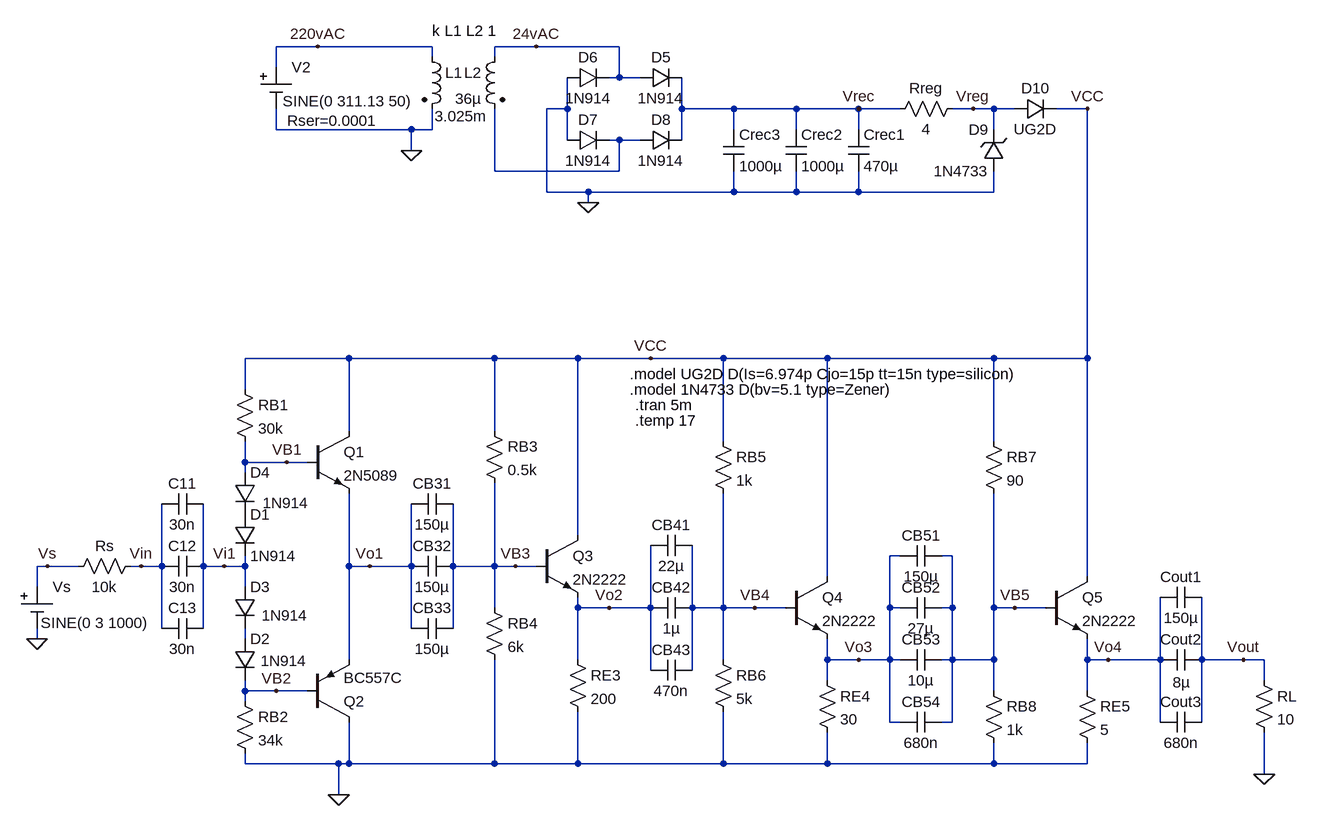
[diagram p0: schematic Draft2.asc]
Draft2.asc, the LTspice schematic file:
Version 4
SHEET 1 2888 1060
WIRE -672 -704 -736 -704
WIRE -496 -704 -672 -704
WIRE -336 -704 -400 -704
WIRE -208 -704 -336 -704
WIRE -496 -688 -496 -704
WIRE -400 -688 -400 -704
WIRE -736 -672 -736 -704
WIRE -208 -656 -208 -704
WIRE -208 -656 -224 -656
WIRE -176 -656 -208 -656
WIRE -288 -608 -288 -656
WIRE -288 -608 -320 -608
WIRE -112 -608 -112 -656
WIRE -32 -608 -112 -608
WIRE 64 -608 -32 -608
WIRE 160 -608 64 -608
WIRE 224 -608 160 -608
WIRE 336 -608 304 -608
WIRE 368 -608 336 -608
WIRE 400 -608 368 -608
WIRE 512 -608 464 -608
WIRE -736 -576 -736 -608
WIRE -528 -576 -736 -576
WIRE -496 -576 -496 -608
WIRE -496 -576 -528 -576
WIRE -32 -576 -32 -608
WIRE 64 -576 64 -608
WIRE 160 -576 160 -608
WIRE 368 -576 368 -608
WIRE -288 -560 -288 -608
WIRE -208 -560 -224 -560
WIRE -176 -560 -208 -560
WIRE -112 -560 -112 -608
WIRE -528 -544 -528 -576
WIRE -400 -512 -400 -608
WIRE -208 -512 -208 -560
WIRE -208 -512 -400 -512
WIRE -320 -480 -320 -608
WIRE -256 -480 -320 -480
WIRE -32 -480 -32 -512
WIRE -32 -480 -256 -480
WIRE 64 -480 64 -512
WIRE 64 -480 -32 -480
WIRE 160 -480 160 -512
WIRE 160 -480 64 -480
WIRE 368 -480 368 -512
WIRE 368 -480 160 -480
WIRE -256 -464 -256 -480
WIRE -624 -224 -784 -224
WIRE -400 -224 -624 -224
WIRE -272 -224 -400 -224
WIRE -160 -224 -272 -224
WIRE -48 -224 -160 -224
WIRE 112 -224 -48 -224
WIRE 368 -224 112 -224
WIRE 512 -224 512 -608
WIRE 512 -224 368 -224
WIRE -784 -176 -784 -224
WIRE -624 -112 -624 -224
WIRE -400 -112 -400 -224
WIRE -48 -96 -48 -224
WIRE 368 -96 368 -224
WIRE -784 -64 -784 -96
WIRE -720 -64 -784 -64
WIRE -688 -64 -720 -64
WIRE -784 -48 -784 -64
WIRE -272 48 -272 -224
WIRE 224 80 208 80
WIRE 304 80 288 80
WIRE -1088 96 -1104 96
WIRE -1040 96 -1088 96
WIRE -944 96 -960 96
WIRE -912 96 -912 0
WIRE -912 96 -944 96
WIRE -848 96 -848 0
WIRE -816 96 -848 96
WIRE -784 96 -784 80
WIRE -784 96 -816 96
WIRE -624 96 -624 -16
WIRE -592 96 -624 96
WIRE -528 96 -528 0
WIRE -528 96 -592 96
WIRE -464 96 -464 0
WIRE -400 96 -400 -32
WIRE -400 96 -464 96
WIRE -368 96 -400 96
WIRE -336 96 -368 96
WIRE 112 112 112 -224
WIRE 512 112 512 -224
WIRE -1104 128 -1104 96
WIRE -784 128 -784 96
WIRE -400 160 -400 96
WIRE -272 160 -272 144
WIRE -224 160 -272 160
WIRE -160 160 -160 64
WIRE -160 160 -224 160
WIRE -96 160 -96 64
WIRE -48 160 -48 -16
WIRE -48 160 -96 160
WIRE 0 160 -48 160
WIRE 48 160 0 160
WIRE 208 160 208 80
WIRE 224 160 208 160
WIRE 304 160 304 80
WIRE 304 160 288 160
WIRE 368 160 368 -16
WIRE 400 160 368 160
WIRE 448 160 400 160
WIRE -912 192 -912 96
WIRE -848 192 -848 96
WIRE -528 192 -528 96
WIRE -464 192 -464 96
WIRE -1104 208 -1104 192
WIRE -784 208 -784 192
WIRE -624 240 -624 96
WIRE -272 240 -272 160
WIRE -48 240 -48 160
WIRE 112 240 112 208
WIRE 160 240 112 240
WIRE 208 240 208 160
WIRE 208 240 160 240
WIRE 224 240 208 240
WIRE 304 240 304 160
WIRE 304 240 288 240
WIRE 368 240 368 160
WIRE 368 240 304 240
WIRE 512 240 512 208
WIRE 544 240 512 240
WIRE 624 240 624 144
WIRE 624 240 544 240
WIRE 688 240 688 144
WIRE 752 240 688 240
WIRE 784 240 752 240
WIRE -160 256 -160 160
WIRE -96 256 -96 160
WIRE 112 272 112 240
WIRE 784 272 784 240
WIRE -784 288 -784 272
WIRE -736 288 -784 288
WIRE -688 288 -736 288
WIRE 368 288 368 240
WIRE 512 288 512 240
WIRE -784 304 -784 288
WIRE 208 336 208 240
WIRE 224 336 208 336
WIRE 304 336 304 240
WIRE 304 336 288 336
WIRE 624 336 624 240
WIRE 688 336 688 240
WIRE -784 400 -784 384
WIRE -640 400 -784 400
WIRE -624 400 -624 336
WIRE -624 400 -640 400
WIRE -400 400 -400 240
WIRE -400 400 -624 400
WIRE -272 400 -272 320
WIRE -272 400 -400 400
WIRE -48 400 -48 320
WIRE -48 400 -272 400
WIRE 112 400 112 352
WIRE 112 400 -48 400
WIRE 368 400 368 368
WIRE 368 400 112 400
WIRE 512 400 512 368
WIRE 512 400 368 400
WIRE 784 416 784 352
WIRE -640 448 -640 400
FLAG -1104 208 0
FLAG -640 448 0
FLAG -528 -544 0
FLAG -256 -464 0
FLAG 784 416 0
FLAG -1088 96 Vs
FLAG -944 96 Vin
FLAG -816 96 Vi1
FLAG -160 -224 VCC
FLAG -720 -64 VB1
FLAG -736 288 VB2
FLAG -592 96 Vo1
FLAG -368 96 VB3
FLAG -224 160 Vo2
FLAG 0 160 VB4
FLAG 160 240 Vo3
FLAG 400 160 VB5
FLAG 544 240 Vo4
FLAG 752 240 Vout
FLAG -672 -704 220vAC
FLAG -336 -704 24vAC
FLAG 160 -608 Vrec
FLAG 336 -608 Vreg
FLAG 512 -608 VCC
SYMBOL Misc\\cell -1104 128 R0
WINDOW 123 0 0 Left 0
WINDOW 39 0 0 Left 0
WINDOW 3 6 55 Left 2
SYMATTR Value SINE(0 3 1000)
SYMATTR InstName Vs
SYMBOL res -944 80 R90
WINDOW 0 0 56 VBottom 2
WINDOW 3 32 56 VTop 2
SYMATTR InstName Rs
SYMATTR Value 10k
SYMBOL diode -800 16 R0
SYMATTR InstName D1
SYMATTR Value 1N914
SYMBOL diode -800 208 R0
WINDOW 3 40 34 Left 2
SYMATTR Value 1N914
SYMATTR InstName D2
SYMBOL res -800 -192 R0
SYMATTR InstName RB1
SYMATTR Value 30k
SYMBOL res -800 288 R0
SYMATTR InstName RB2
SYMATTR Value 34k
SYMBOL npn -688 -112 R0
SYMATTR InstName Q1
SYMATTR Value 2N5089
SYMBOL pnp -688 336 M180
SYMATTR InstName Q2
SYMATTR Value BC557C
SYMBOL cap -848 80 R90
WINDOW 0 0 32 VBottom 2
WINDOW 3 32 32 VTop 2
SYMATTR InstName C12
SYMATTR Value 30n
SYMBOL cap -464 80 R90
WINDOW 0 0 32 VBottom 2
WINDOW 3 32 32 VTop 2
SYMATTR InstName CB32
SYMATTR Value 150µ
SYMBOL res -416 -128 R0
SYMATTR InstName RB3
SYMATTR Value 0.5k
SYMBOL res -416 144 R0
SYMATTR InstName RB4
SYMATTR Value 6k
SYMBOL res -288 224 R0
SYMATTR InstName RE3
SYMATTR Value 200
SYMBOL npn -336 48 R0
SYMATTR InstName Q3
SYMATTR Value 2N2222
SYMBOL res 768 256 R0
SYMATTR InstName RL
SYMATTR Value 10
SYMBOL cap -96 144 R90
WINDOW 0 0 32 VBottom 2
WINDOW 3 32 32 VTop 2
SYMATTR InstName CB42
SYMATTR Value 1µ
SYMBOL res -64 -112 R0
SYMATTR InstName RB5
SYMATTR Value 1k
SYMBOL res -64 224 R0
SYMATTR InstName RB6
SYMATTR Value 5k
SYMBOL res 96 256 R0
SYMATTR InstName RE4
SYMATTR Value 30
SYMBOL npn 48 112 R0
SYMATTR InstName Q4
SYMATTR Value 2N2222
SYMBOL cap 288 224 R90
WINDOW 0 0 32 VBottom 2
WINDOW 3 32 32 VTop 2
SYMATTR InstName CB53
SYMATTR Value 10µ
SYMBOL res 352 -112 R0
SYMATTR InstName RB7
SYMATTR Value 90
SYMBOL res 352 272 R0
SYMATTR InstName RB8
SYMATTR Value 1k
SYMBOL res 496 272 R0
SYMATTR InstName RE5
SYMATTR Value 5
SYMBOL npn 448 112 R0
SYMATTR InstName Q5
SYMATTR Value 2N2222
SYMBOL cap 688 224 R90
WINDOW 0 0 32 VBottom 2
WINDOW 3 35 31 VTop 2
SYMATTR InstName Cout2
SYMATTR Value 8µ
SYMBOL diode -800 128 R0
WINDOW 3 42 44 Left 2
SYMATTR Value 1N914
SYMATTR InstName D3
SYMBOL diode -800 -48 R0
WINDOW 3 43 47 Left 2
SYMATTR Value 1N914
SYMATTR InstName D4
SYMBOL Misc\\cell -736 -672 R0
WINDOW 3 10 52 Left 2
WINDOW 123 0 0 Left 0
WINDOW 39 17 82 Left 2
SYMATTR Value SINE(0 311.13 50)
SYMATTR SpiceLine Rser=0.0001
SYMATTR InstName V2
SYMBOL ind2 -512 -704 R0
WINDOW 3 20 107 Left 2
SYMATTR Value 3.025m
SYMATTR InstName L1
SYMBOL ind2 -384 -704 M0
SYMATTR InstName L2
SYMATTR Value 36µ
SYMBOL cap 144 -576 R0
SYMATTR InstName Crec1
SYMATTR Value 470µ
SYMBOL res 320 -624 R90
WINDOW 0 0 56 VBottom 2
WINDOW 3 32 56 VTop 2
SYMATTR InstName Rreg
SYMATTR Value 4
SYMBOL zener 384 -512 R180
WINDOW 0 24 64 Left 2
WINDOW 3 24 0 Left 2
SYMATTR InstName D9
SYMATTR Value 1N4733
SYMBOL diode -176 -640 R270
WINDOW 0 32 32 VTop 2
WINDOW 3 0 32 VBottom 2
SYMATTR InstName D5
SYMATTR Value 1N914
SYMBOL diode -288 -640 R270
WINDOW 0 32 32 VTop 2
WINDOW 3 0 32 VBottom 2
SYMATTR InstName D6
SYMATTR Value 1N914
SYMBOL diode -288 -544 R270
WINDOW 0 32 32 VTop 2
WINDOW 3 0 32 VBottom 2
SYMATTR InstName D7
SYMATTR Value 1N914
SYMBOL diode -176 -544 R270
WINDOW 0 32 32 VTop 2
WINDOW 3 0 32 VBottom 2
SYMATTR InstName D8
SYMATTR Value 1N914
SYMBOL diode 400 -592 R270
WINDOW 0 32 32 VTop 2
WINDOW 3 0 32 VBottom 2
SYMATTR InstName D10
SYMATTR Value UG2D
SYMBOL cap 48 -576 R0
SYMATTR InstName Crec2
SYMATTR Value 1000µ
SYMBOL cap -48 -576 R0
SYMATTR InstName Crec3
SYMATTR Value 1000µ
SYMBOL cap -848 -16 R90
WINDOW 0 0 32 VBottom 2
WINDOW 3 32 32 VTop 2
SYMATTR InstName C11
SYMATTR Value 30n
SYMBOL cap -848 176 R90
WINDOW 0 0 32 VBottom 2
WINDOW 3 32 32 VTop 2
SYMATTR InstName C13
SYMATTR Value 30n
SYMBOL cap -464 -16 R90
WINDOW 0 0 32 VBottom 2
WINDOW 3 32 32 VTop 2
SYMATTR InstName CB31
SYMATTR Value 150µ
SYMBOL cap -464 176 R90
WINDOW 0 0 32 VBottom 2
WINDOW 3 32 32 VTop 2
SYMATTR InstName CB33
SYMATTR Value 150µ
SYMBOL cap -96 48 R90
WINDOW 0 0 32 VBottom 2
WINDOW 3 32 32 VTop 2
SYMATTR InstName CB41
SYMATTR Value 22µ
SYMBOL cap -96 240 R90
WINDOW 0 0 32 VBottom 2
WINDOW 3 32 32 VTop 2
SYMATTR InstName CB43
SYMATTR Value 470n
SYMBOL cap 688 128 R90
WINDOW 0 0 32 VBottom 2
WINDOW 3 32 32 VTop 2
SYMATTR InstName Cout1
SYMATTR Value 150µ
SYMBOL cap 688 320 R90
WINDOW 0 0 32 VBottom 2
WINDOW 3 32 32 VTop 2
SYMATTR InstName Cout3
SYMATTR Value 680n
SYMBOL cap 288 320 R90
WINDOW 0 0 32 VBottom 2
WINDOW 3 32 32 VTop 2
SYMATTR InstName CB54
SYMATTR Value 680n
SYMBOL cap 288 144 R90
WINDOW 0 0 32 VBottom 2
WINDOW 3 32 32 VTop 2
SYMATTR InstName CB52
SYMATTR Value 27µ
SYMBOL cap 288 64 R90
WINDOW 0 0 32 VBottom 2
WINDOW 3 32 32 VTop 2
SYMATTR InstName CB51
SYMATTR Value 150µ
TEXT -184 -128 Left 2 !.temp 17
TEXT -184 -152 Left 2 !.tran 5m
TEXT -496 -728 Left 2 !k L1 L2 1
TEXT -192 -176 Left 2 !.model 1N4733 D(bv=5.1 type=Zener)
TEXT -192 -200 Left 2 !.model UG2D D(Is=6.974p Cjo=15p tt=15n type=silicon)

The netlist it stands for:
* Draft2.asc
Vs Vs 0 SINE(0 3 1000)
Rs Vin Vs 10k
D1 P001 Vi1 1N914
D2 N002 VB2 1N914
RB1 VCC VB1 30k
RB2 VB2 0 34k
Q1 VCC VB1 Vo1 0 2N5089
Q2 0 VB2 Vo1 0 BC557C
C12 Vi1 Vin 30n
CB32 VB3 Vo1 150µ
RB3 VCC VB3 0.5k
RB4 VB3 0 6k
RE3 Vo2 0 200
Q3 VCC VB3 Vo2 0 2N2222
RL Vout 0 10
CB42 VB4 Vo2 1µ
RB5 VCC VB4 1k
RB6 VB4 0 5k
RE4 Vo3 0 30
Q4 VCC VB4 Vo3 0 2N2222
CB53 VB5 Vo3 10µ
RB7 VCC VB5 90
RB8 VB5 0 1k
RE5 Vo4 0 5
Q5 VCC VB5 Vo4 0 2N2222
Cout2 Vout Vo4 8µ
D3 Vi1 N002 1N914
D4 VB1 P001 1N914
V2 220vAC 0 SINE(0 311.13 50) Rser=0.0001
L1 220vAC 0 3.025m
L2 24vAC N001 36µ
Crec1 Vrec 0 470µ
Rreg Vreg Vrec 4
D9 0 Vreg 1N4733
D5 24vAC Vrec 1N914
D6 0 24vAC 1N914
D7 0 N001 1N914
D8 N001 Vrec 1N914
D10 Vreg VCC UG2D
Crec2 Vrec 0 1000µ
Crec3 Vrec 0 1000µ
C11 Vi1 Vin 30n
C13 Vi1 Vin 30n
CB31 VB3 Vo1 150µ
CB33 VB3 Vo1 150µ
CB41 VB4 Vo2 22µ
CB43 VB4 Vo2 470n
Cout1 Vout Vo4 150µ
Cout3 Vout Vo4 680n
CB54 VB5 Vo3 680n
CB52 VB5 Vo3 27µ
CB51 VB5 Vo3 150µ
.model D D
.lib standard.dio
.model NPN NPN
.model PNP PNP
.lib standard.bjt
.temp 17
.tran 5m
k L1 L2 1
.model 1N4733 D(bv=5.1 type=Zener)
.model UG2D D(Is=6.974p Cjo=15p tt=15n type=silicon)
.backanno
.end